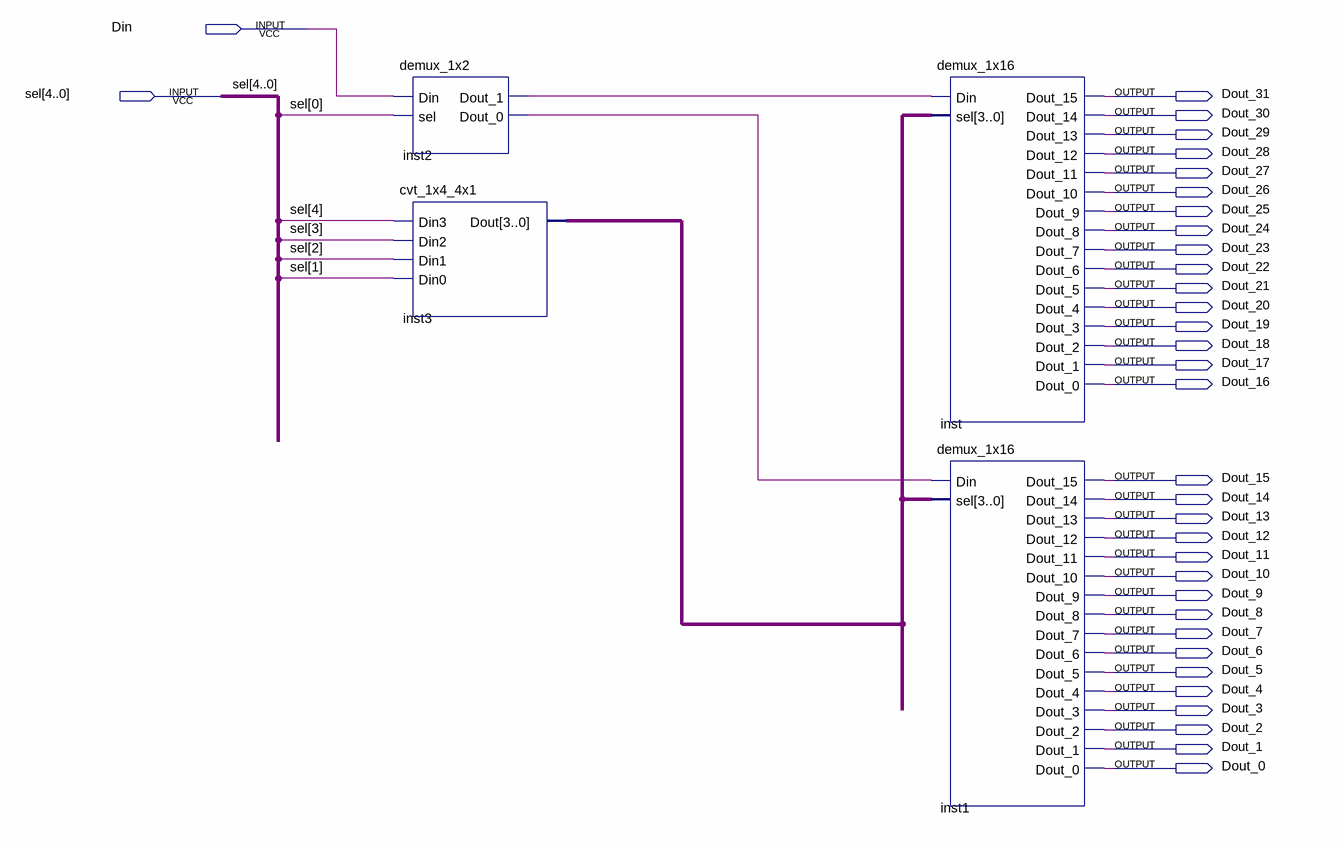
[diagram p0: schematic sheet]
// Quartus schematic demux_1x32.bdf as structural Verilog: 4 symbols, 34 pins
module demux_1x32 (
  input  Din,
  input  [4:0] sel,
  output Dout_31,
  output Dout_30,
  output Dout_29,
  output Dout_28,
  output Dout_27,
  output Dout_26,
  output Dout_25,
  output Dout_24,
  output Dout_23,
  output Dout_22,
  output Dout_21,
  output Dout_20,
  output Dout_19,
  output Dout_18,
  output Dout_17,
  output Dout_16,
  output Dout_15,
  output Dout_14,
  output Dout_13,
  output Dout_12,
  output Dout_11,
  output Dout_10,
  output Dout_9,
  output Dout_8,
  output Dout_7,
  output Dout_6,
  output Dout_5,
  output Dout_4,
  output Dout_3,
  output Dout_2,
  output Dout_1,
  output Dout_0
);

  wire inst2_dout_0, inst2_dout_1;
  wire [3:0] inst3_dout;

  demux_1x2 inst2 (.Din(Din), .sel(sel[0]), .Dout_1(inst2_dout_1), .Dout_0(inst2_dout_0));
  cvt_1x4_4x1 inst3 (.Din3(sel[4]), .Din2(sel[3]), .Din1(sel[2]), .Din0(sel[1]), .Dout(inst3_dout));
  demux_1x16 inst (
    .Din(inst2_dout_1), .sel(inst3_dout), .Dout_15(Dout_31), .Dout_14(Dout_30), .Dout_13(Dout_29),
    .Dout_12(Dout_28), .Dout_11(Dout_27), .Dout_10(Dout_26), .Dout_9(Dout_25), .Dout_8(Dout_24),
    .Dout_7(Dout_23), .Dout_6(Dout_22), .Dout_5(Dout_21), .Dout_4(Dout_20), .Dout_3(Dout_19),
    .Dout_2(Dout_18), .Dout_1(Dout_17), .Dout_0(Dout_16));
  demux_1x16 inst1 (
    .Din(inst2_dout_0), .sel(inst3_dout), .Dout_15(Dout_15), .Dout_14(Dout_14), .Dout_13(Dout_13),
    .Dout_12(Dout_12), .Dout_11(Dout_11), .Dout_10(Dout_10), .Dout_9(Dout_9), .Dout_8(Dout_8),
    .Dout_7(Dout_7), .Dout_6(Dout_6), .Dout_5(Dout_5), .Dout_4(Dout_4), .Dout_3(Dout_3), .Dout_2(Dout_2),
    .Dout_1(Dout_1), .Dout_0(Dout_0));
endmodule
